# Altium schematic sheet 03- Power Decoupling.SchDoc: Power Decoupling
size A3; Page Number: 3; Page Size: B; Page Count: 12; Board Rev: B; Project Name: CrossLink-NX Evaluation Board; RevCode: 1.0; Doc: 305-PD-19-0819; DsnPath: C:\Users\HAltinkilit\Downloads\Crosslink-NX-Design-Files\CrossLink-NX-Eval-Brd-Schematic-RevB-191122.DSN; SchematicName: SCHEMATIC1; PageName: 12 - Power Decoupling; PageSize: B; TopSchematic: True
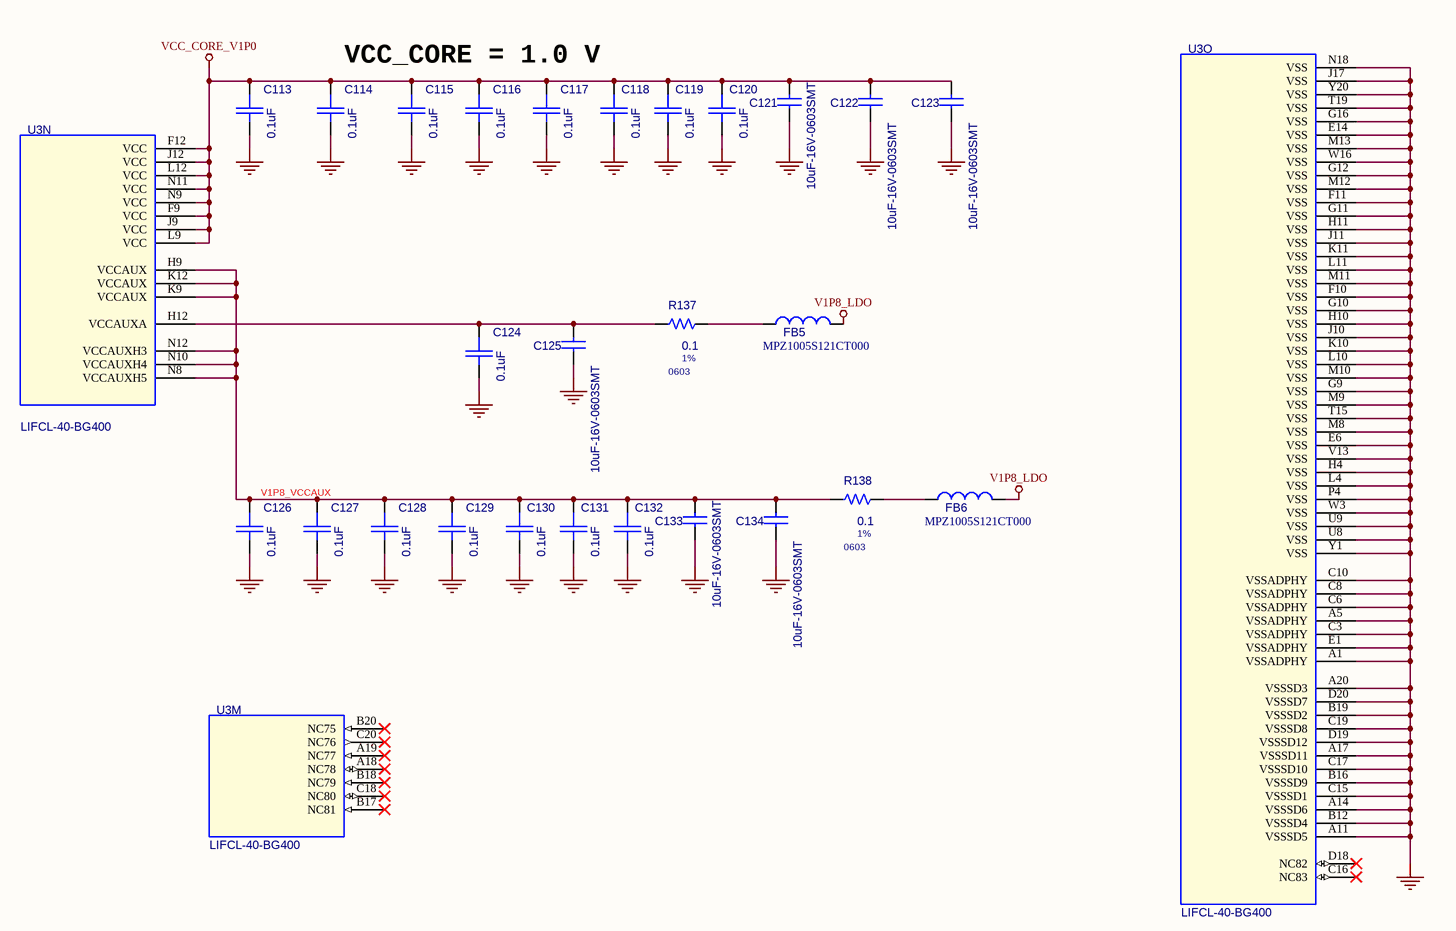
[diagram p0: 03- Power Decoupling.SchDoc]

## Parts
C113  0.1uF  [C0201]
C114  0.1uF  [C0201]
C115  0.1uF  [C0201]
C116  0.1uF  [C0201]
C117  0.1uF  [C0201]
C118  0.1uF  [C0201]
C119  0.1uF  [C0201]
C120  0.1uF  [C0201]
C121  10uF-16V-0603SMT  [C0603]
C122  10uF-16V-0603SMT  [C0603]
C123  10uF-16V-0603SMT  [C0603]
C124  0.1uF  [C0201]
C125  10uF-16V-0603SMT  [C0603]
C126  0.1uF  [C0201]
C127  0.1uF  [C0201]
C128  0.1uF  [C0201]
C129  0.1uF  [C0201]
C130  0.1uF  [C0201]
C131  0.1uF  [C0201]
C132  0.1uF  [C0201]
C133  10uF-16V-0603SMT  [C0603]
C134  10uF-16V-0603SMT  [C0603]
FB5  MPZ1005S121CT000  [FB0402]
FB6  MPZ1005S121CT000  [FB0402]
R137  0.1  Tollerance: 1%  [0603]
R138  0.1  Tollerance: 1%  [0603]
U3  LIFCL-40-BG400  [LIFCL-40-BG400]  (parts M,N,O of 15)

## Nets
GND: C113.2 C114.2 C115.2 C116.2 C117.2 C118.2 C119.2 C120.2 C121.1 C122.1 C123.1 C124.2 C125.1 C126.2 C127.2 C128.2 C129.2 C130.2 C131.2 C132.2 C133.1 C134.1 U3.A1(VSSADPHY) U3.A5(VSSADPHY) U3.A11(VSSSD5) U3.A14(VSSSD6) U3.A17(VSSSD11) U3.A20(VSSSD3) U3.B12(VSSSD4) U3.B16(VSSSD9) U3.B19(VSSSD2) U3.C3(VSSADPHY) U3.C6(VSSADPHY) U3.C8(VSSADPHY) U3.C10(VSSADPHY) U3.C15(VSSSD1) U3.C17(VSSSD10) U3.C19(VSSSD8) U3.D19(VSSSD12) U3.D20(VSSSD7) U3.E1(VSSADPHY) U3.E6(VSS) U3.E14(VSS) U3.F10(VSS) U3.F11(VSS) U3.G9(VSS) U3.G10(VSS) U3.G11(VSS) U3.G12(VSS) U3.G16(VSS) U3.H4(VSS) U3.H10(VSS) U3.H11(VSS) U3.J10(VSS) U3.J11(VSS) U3.J17(VSS) U3.K10(VSS) U3.K11(VSS) U3.L4(VSS) U3.L10(VSS) U3.L11(VSS) U3.M8(VSS) U3.M9(VSS) U3.M10(VSS) U3.M11(VSS) U3.M12(VSS) U3.M13(VSS) U3.N18(VSS) U3.P4(VSS) U3.T15(VSS) U3.T19(VSS) U3.U8(VSS) U3.U9(VSS) U3.V13(VSS) U3.W3(VSS) U3.W16(VSS) U3.Y1(VSS) U3.Y20(VSS)
V1P8_LDO: FB5.2 FB6.2
VCC_CORE_V1P0: C113.1 C114.1 C115.1 C116.1 C117.1 C118.1 C119.1 C120.1 C121.2 C122.2 C123.2 U3.F9(VCC) U3.F12(VCC) U3.J9(VCC) U3.J12(VCC) U3.L9(VCC) U3.L12(VCC) U3.N9(VCC) U3.N11(VCC)
V1P8_VCCAUX: C126.1 C127.1 C128.1 C129.1 C130.1 C131.1 C132.1 C133.2 C134.2 R138.1 U3.H9(VCCAUX) U3.K9(VCCAUX) U3.K12(VCCAUX) U3.N8(VCCAUXH5) U3.N10(VCCAUXH4) U3.N12(VCCAUXH3)
NetC124_1: C124.1 C125.2 R137.1 U3.H12(VCCAUXA)
NetFB5_1: FB5.1 R137.2
NetFB6_1: FB6.1 R138.2

Not connected (* = marked no-connect by the designer): U3 A18(NC78)* A19(NC77)* B17(NC81)* B18(NC79)* B20(NC75)* C16(NC83)* C18(NC80)* C20(NC76)* D18(NC82)*

## Notes on the sheet
- VCC_CORE = 1.0 V
- Proje/Project:
- Sayfa Adı/Document Name:
- Çizilme Tarihi/Drawing Date
- Umit KAYACIK
- Tasarlayan/Designed By
- Sayfa/Sheet:
- Revision:
- of
- Son Güncelleme/Last Edit Date
- Kontrol eden/Checked By
- Onaylayan/Approved By
- Boyut/Size:
- Varyant/Variant:
- Dil/Language:
- A3
- ENG

## Library data of the parts
C113 = CAP_1: CAP CER 0.1UF 25V 10% X5R 0201; Part Reference: C113; Manufacturer: Murata; Manufacturer Part Number: GRM033R61E104KE14J; Value: 0.1uF; Assy: -; PCB Footprint: C0201
C114 = CAP_1: CAP CER 0.1UF 25V 10% X5R 0201; Part Reference: C114; Manufacturer: Murata; Manufacturer Part Number: GRM033R61E104KE14J; Value: 0.1uF; Assy: -; PCB Footprint: C0201
C115 = CAP_1: CAP CER 0.1UF 25V 10% X5R 0201; Part Reference: C115; Manufacturer: Murata; Manufacturer Part Number: GRM033R61E104KE14J; Value: 0.1uF; Assy: -; PCB Footprint: C0201
C116 = CAP_1: CAP CER 0.1UF 25V 10% X5R 0201; Part Reference: C116; Manufacturer: Murata; Manufacturer Part Number: GRM033R61E104KE14J; Value: 0.1uF; Assy: -; PCB Footprint: C0201
C117 = CAP_1: CAP CER 0.1UF 25V 10% X5R 0201; Part Reference: C117; Manufacturer: Murata; Manufacturer Part Number: GRM033R61E104KE14J; Value: 0.1uF; Assy: -; PCB Footprint: C0201
C118 = CAP_SMT_0805: CAP CER 0.1UF 25V 10% X5R 0201; Part Reference: C118; Manufacturer: Murata; Manufacturer Part Number: GRM033R61E104KE14J; Value: 0.1uF; Assy: -; PCB Footprint: C0201
C119 = CAP_SMT_0805: CAP CER 0.1UF 25V 10% X5R 0201; Part Reference: C119; Manufacturer: Murata; Manufacturer Part Number: GRM033R61E104KE14J; Value: 0.1uF; Assy: -; PCB Footprint: C0201
C120 = CAP_SMT_0805: CAP CER 0.1UF 25V 10% X5R 0201; Part Reference: C120; Manufacturer: Murata; Manufacturer Part Number: GRM033R61E104KE14J; Value: 0.1uF; Assy: -; PCB Footprint: C0201
C121 = CAP NP_Dup1: Part Reference: C121; FPLIST: SM/C_0402; COMPSIDE: TOP; COMPLOC: [1820.000,2015.000]; COMPROT: 270; COMPGROUP: 0; COMPFIXED: NO; COMPHEIGHT: 0.000; Value: 10uF-16V-0603SMT; Assy: -; COMPLOCKED: NO; COMPKEY: NO; DECOUPLER: NO; MEMORY: NO; PCB Footprint: C0603
C122 = CAP NP_Dup1: Part Reference: C122; FPLIST: SM/C_0402; COMPSIDE: TOP; COMPLOC: [1820.000,2015.000]; COMPROT: 270; COMPGROUP: 0; COMPFIXED: NO; COMPHEIGHT: 0.000; Value: 10uF-16V-0603SMT; Assy: -; COMPLOCKED: NO; COMPKEY: NO; DECOUPLER: NO; MEMORY: NO; PCB Footprint: C0603
C123 = CAP NP_Dup1: Part Reference: C123; FPLIST: SM/C_0402; COMPSIDE: TOP; COMPLOC: [1820.000,2015.000]; COMPROT: 270; COMPGROUP: 0; COMPFIXED: NO; COMPHEIGHT: 0.000; Value: 10uF-16V-0603SMT; Assy: -; COMPLOCKED: NO; COMPKEY: NO; DECOUPLER: NO; MEMORY: NO; PCB Footprint: C0603
C124 = CAP_1: CAP CER 0.1UF 25V 10% X5R 0201; Part Reference: C124; Manufacturer: Murata; Manufacturer Part Number: GRM033R61E104KE14J; Value: 0.1uF; Assy: -; PCB Footprint: C0201
C125 = CAP NP_Dup1: Part Reference: C125; COMPHEIGHT: 0.000; MEMORY: NO; COMPGROUP: 0; COMPROT: 270; COMPLOC: [1820.000,2015.000]; COMPSIDE: TOP; FPLIST: SM/C_0402; Value: 10uF-16V-0603SMT; Assy: -; DECOUPLER: NO; COMPKEY: NO; COMPLOCKED: NO; COMPFIXED: NO; PCB Footprint: C0603
C126 = CAP_1: CAP CER 0.1UF 25V 10% X5R 0201; Part Reference: C126; Manufacturer: Murata; Manufacturer Part Number: GRM033R61E104KE14J; Value: 0.1uF; Assy: -; PCB Footprint: C0201
C127 = CAP_1: CAP CER 0.1UF 25V 10% X5R 0201; Part Reference: C127; Manufacturer: Murata; Manufacturer Part Number: GRM033R61E104KE14J; Value: 0.1uF; Assy: -; PCB Footprint: C0201
C128 = CAP_1: CAP CER 0.1UF 25V 10% X5R 0201; Part Reference: C128; Manufacturer Part Number: GRM033R61E104KE14J; Manufacturer: Murata; Value: 0.1uF; Assy: -; PCB Footprint: C0201
C129 = CAP_1: CAP CER 0.1UF 25V 10% X5R 0201; Part Reference: C129; Manufacturer: Murata; Manufacturer Part Number: GRM033R61E104KE14J; Value: 0.1uF; Assy: -; PCB Footprint: C0201
C130 = CAP_SMT_0805: CAP CER 0.1UF 25V 10% X5R 0201; Part Reference: C130; Manufacturer: Murata; Manufacturer Part Number: GRM033R61E104KE14J; Value: 0.1uF; Assy: -; PCB Footprint: C0201
C131 = CAP_SMT_0805: CAP CER 0.1UF 25V 10% X5R 0201; Part Reference: C131; Manufacturer: Murata; Manufacturer Part Number: GRM033R61E104KE14J; Value: 0.1uF; Assy: -; PCB Footprint: C0201
C132 = CAP_SMT_0805: CAP CER 0.1UF 25V 10% X5R 0201; Part Reference: C132; Manufacturer: Murata; Manufacturer Part Number: GRM033R61E104KE14J; Value: 0.1uF; Assy: -; PCB Footprint: C0201
C133 = CAP NP_Dup1: Part Reference: C133; COMPHEIGHT: 0.000; MEMORY: NO; COMPGROUP: 0; COMPROT: 270; COMPLOC: [1820.000,2015.000]; COMPSIDE: TOP; FPLIST: SM/C_0402; Value: 10uF-16V-0603SMT; Assy: -; DECOUPLER: NO; COMPKEY: NO; COMPLOCKED: NO; COMPFIXED: NO; PCB Footprint: C0603
C134 = CAP NP_Dup1: Part Reference: C134; COMPHEIGHT: 0.000; MEMORY: NO; COMPGROUP: 0; COMPROT: 270; COMPLOC: [1820.000,2015.000]; COMPSIDE: TOP; FPLIST: SM/C_0402; Value: 10uF-16V-0603SMT; Assy: -; DECOUPLER: NO; COMPKEY: NO; COMPLOCKED: NO; COMPFIXED: NO; PCB Footprint: C0603
FB5 = INDUCTOR_0: FERRITE BEAD 120 OHM 0402 1LN; Part Reference: FB5; Manufacturer: TDK Corporation; Value: MPZ1005S121CT000; Assy: -; PCB Footprint: FB0402; Manufacturer Part Number: MPZ1005S121CT000
FB6 = INDUCTOR_0: FERRITE BEAD 120 OHM 0402 1LN; Part Reference: FB6; Manufacturer: TDK Corporation; Value: MPZ1005S121CT000; Assy: -; PCB Footprint: FB0402; Manufacturer Part Number: MPZ1005S121CT000
R137 = R_Dup2: Part Reference: R137; DIST: FLAT; PSpiceTemplate: R^@REFDES %1 %2 ?TOLERANCE|R^@REFDES| @VALUE  ?TOLERANCE|\n.model R^@REFDES RES R=1 DEV=@TOLERANCE%|; VOLTAGE: RVMAX; SLOPE: RSMAX; MAX_TEMP: RTMAX; POWER: RMAX; FPLIST: AX/RC05,SM/R_0603; COMPSIDE: TOP; COMPLOC: [970.000,1160.000]; COMPROT: 180; COMPGROUP: 0; COMPFIXED: NO; COMPHEIGHT: 0.000; Value: 0.1; Assy: -; COMPLOCKED: NO; COMPKEY: NO; DECOUPLER: NO; MEMORY: NO; PCB Footprint: 0603
R138 = R_Dup2: Part Reference: R138; DIST: FLAT; PSpiceTemplate: R^@REFDES %1 %2 ?TOLERANCE|R^@REFDES| @VALUE  ?TOLERANCE|\n.model R^@REFDES RES R=1 DEV=@TOLERANCE%|; VOLTAGE: RVMAX; SLOPE: RSMAX; MAX_TEMP: RTMAX; POWER: RMAX; FPLIST: AX/RC05,SM/R_0603; COMPSIDE: TOP; COMPLOC: [970.000,1160.000]; COMPROT: 180; COMPGROUP: 0; COMPFIXED: NO; COMPHEIGHT: 0.000; Value: 0.1; Assy: -; COMPLOCKED: NO; COMPKEY: NO; DECOUPLER: NO; MEMORY: NO; PCB Footprint: 0603
U3 = LIFCL-40-BG400: Part Reference: U3; Source Part: LIFCL-40-BG400A.Normal; SWAP_INFO: (S1+S2+S3+S4+S5+S6+S7+S8+S9+S10+S11+S12+S13+S14+S15); SPLIT_INST: TRUE; Name: I17266603; Primitive: DEFAULT; Implementation Type: <none>; Location X-Coordinate: 0; Source Library: C:\USERS\SLIU1\DOCUMENTS\PCB_DESIGN\JEDI_EVAL_BOARD\SCHEMATIC\LIFCL40.OLB; Power Pins Visible: False; Value: LIFCL-40-BG400; Location Y-Coordinate: 0; Color: Default; Source Package: LIFCL-40-BG400; Graphic: LIFCL-40-BG400A.Normal; Assy: -; PCB Footprint: LIFCL-40-BG400